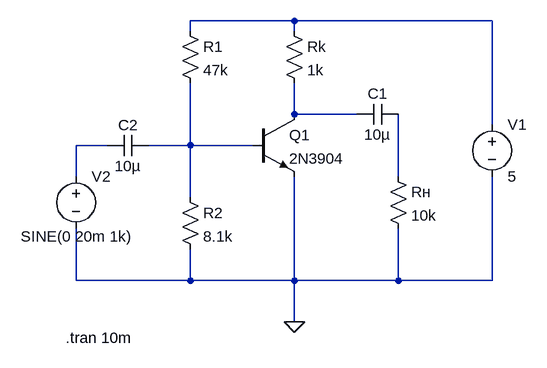
[diagram p0: schematic lab4.asc]
lab4.asc, the LTspice schematic file:
Version 4
SHEET 1 880 680
WIRE 192 -32 32 -32
WIRE 496 -32 192 -32
WIRE 32 -16 32 -32
WIRE 192 -16 192 -32
WIRE 192 112 192 64
WIRE 288 112 192 112
WIRE 496 128 496 -32
WIRE -96 160 -144 160
WIRE 32 160 32 64
WIRE 32 160 -32 160
WIRE 128 160 32 160
WIRE -144 208 -144 160
WIRE 352 208 352 112
WIRE 32 240 32 160
WIRE -144 368 -144 288
WIRE 32 368 32 320
WIRE 32 368 -144 368
WIRE 192 368 192 208
WIRE 192 368 32 368
WIRE 352 368 352 288
WIRE 352 368 192 368
WIRE 496 368 496 208
WIRE 496 368 352 368
WIRE 192 432 192 368
FLAG 192 432 0
SYMBOL npn 128 112 R0
SYMATTR InstName Q1
SYMATTR Value 2N3904
SYMBOL res 176 -32 R0
SYMATTR InstName Rk
SYMATTR Value 1k
SYMBOL res 16 -32 R0
SYMATTR InstName R1
SYMATTR Value 47k
SYMBOL res 16 224 R0
SYMATTR InstName R2
SYMATTR Value 8.1k
SYMBOL res 336 192 R0
SYMATTR InstName Rн
SYMATTR Value 10k
SYMBOL cap 352 96 R90
WINDOW 0 0 32 VBottom 2
WINDOW 3 32 32 VTop 2
SYMATTR InstName C1
SYMATTR Value 10µ
SYMBOL cap -32 144 R90
WINDOW 0 0 32 VBottom 2
WINDOW 3 32 32 VTop 2
SYMATTR InstName C2
SYMATTR Value 10µ
SYMBOL voltage 496 112 R0
WINDOW 123 0 0 Left 0
WINDOW 39 0 0 Left 0
SYMATTR InstName V1
SYMATTR Value 5
SYMBOL voltage -144 192 R0
WINDOW 3 -85 108 Left 2
WINDOW 123 0 0 Left 0
WINDOW 39 0 0 Left 0
SYMATTR InstName V2
SYMATTR Value SINE(0 20m 1k)
TEXT -160 456 Left 2 !.tran 10m

The netlist it stands for:
* lab4.asc
Q1 N002 N004 0 0 2N3904
Rk N001 N002 1k
R1 N001 N004 47k
R2 N004 0 8.1k
Rн N005 0 10k
C1 N005 N002 10µ
C2 N004 N003 10µ
V1 N001 0 5
V2 N003 0 SINE(0 20m 1k)
.model NPN NPN
.model PNP PNP
.lib standard.bjt
.tran 10m
.backanno
.end